# Altium schematic sheet DSO_Trig.SchDoc: Schematic_Name
size A4; CompanyName: University of Melbourne; Engineer: Your Name Here; DocumentNumber: 1; Revision: 0.1; SheetNumber: 1; SheetTotal: 1; Title_Project: Project_Title; StudentNo: Student No.
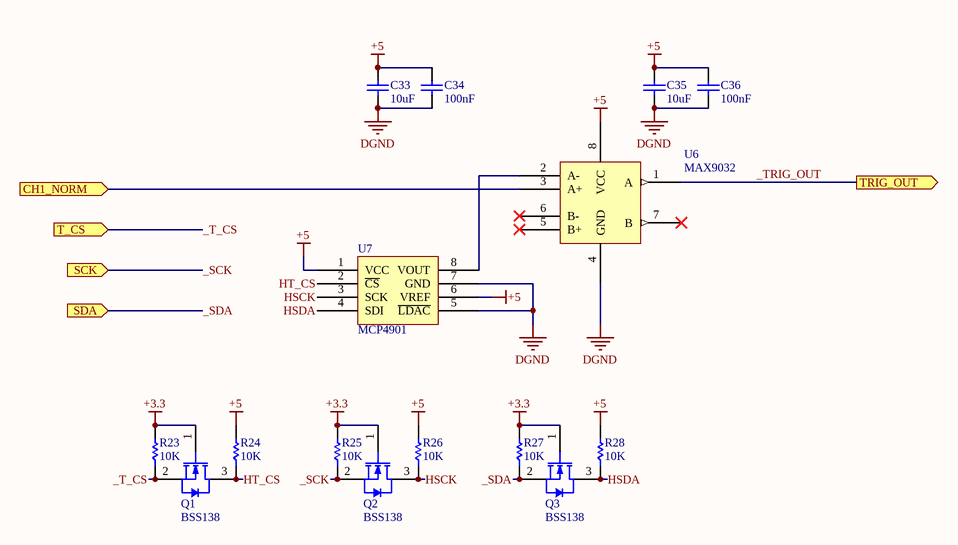
[diagram p0: DSO_Trig.SchDoc]

## Parts
C33  10uF  [0805C]
C34  100nF  [0805C]
C35  10uF  [0805C]
C36  100nF  [0805C]
Q1  BSS138  [SOT23]
Q2  BSS138  [SOT23]
Q3  BSS138  [SOT23]
R23  10K  [0805]
R24  10K  [0805]
R25  10K  [0805]
R26  10K  [0805]
R27  10K  [0805]
R28  10K  [0805]
U6  MAX9032  [SOIC-8]
U7  MCP4901  [SOIC-8]

## Ports
CH1_NORM (in), SCK (in), SDA (in), T_CS (in), TRIG_OUT (out)

## Nets
+3.3: Q1.1(G) Q2.1(G) Q3.1(G) R23.2 R25.2 R27.2
+5: C33.1 C34.1 C35.1 C36.1 R24.2 R26.2 R28.2 U6.8(VCC) U7.1(VCC) U7.6(VREF)
DGND: C33.2 C34.2 C35.2 C36.2 U6.4(GND) U7.5(~{LDAC}) U7.7(GND)
_SCK: Q2.2(S) R25.1 ; port SCK
_SDA: Q3.2(S) R27.1 ; port SDA
_T_CS: Q1.2(S) R23.1 ; port T_CS
_TRIG_OUT: U6.1(A) ; port TRIG_OUT
CH1_NORM: U6.3(A+) ; port CH1_NORM
HSCK: Q2.3(D) R26.1 U7.3(SCK)
HSDA: Q3.3(D) R28.1 U7.4(SDI)
HT_CS: Q1.3(D) R24.1 U7.2(~{CS})
NetU6_2: U6.2(A-) U7.8(VOUT)

Not connected (* = marked no-connect by the designer): U6 5(B+)* 6(B-)* 7(B)*

## Library data of the parts
C33-C36 = C: Capacitor; Reviewed by: RM - 2018/08/05; Revision: July-2002: Re-released for DXP Platform.; Supplier 1: *; Supplier Part Number 1: *
  C33 C35: Value: 10uF
  C34 C36: Value: 100nF
Q1-Q3 = MOSFET-N: N-Channel MOSFET; PackageDocument: 1995/1996; Published: 8-Jun-2000; LatestRevisionDate: 17-Jul-2002; LatestRevisionNote: Re-released for DXP Platform.; PackageReference: E3; Publisher: Altium Limited
R23-R28 = R: Resistor; Reviewed by: RM - 2018/08/05; Supplier 1: *; Suppler Part Number 1: *; Value: 10K
U6 = MAX9032: Dual Comparator; Reviewed by: RM - 2018/08/05; Supplier 1: Digi-Key; Supplier Part Number 1: MAX9032ASA-ND
U7 = MCP4901: DAC 8bit SPI; Reviewed by: RM - 2018/08/05; Supplier 1: Digi-Key; Supplier Part Number 1: MCP4901-E/SN-ND